# Altium schematic sheet xe.SchDoc
size A2
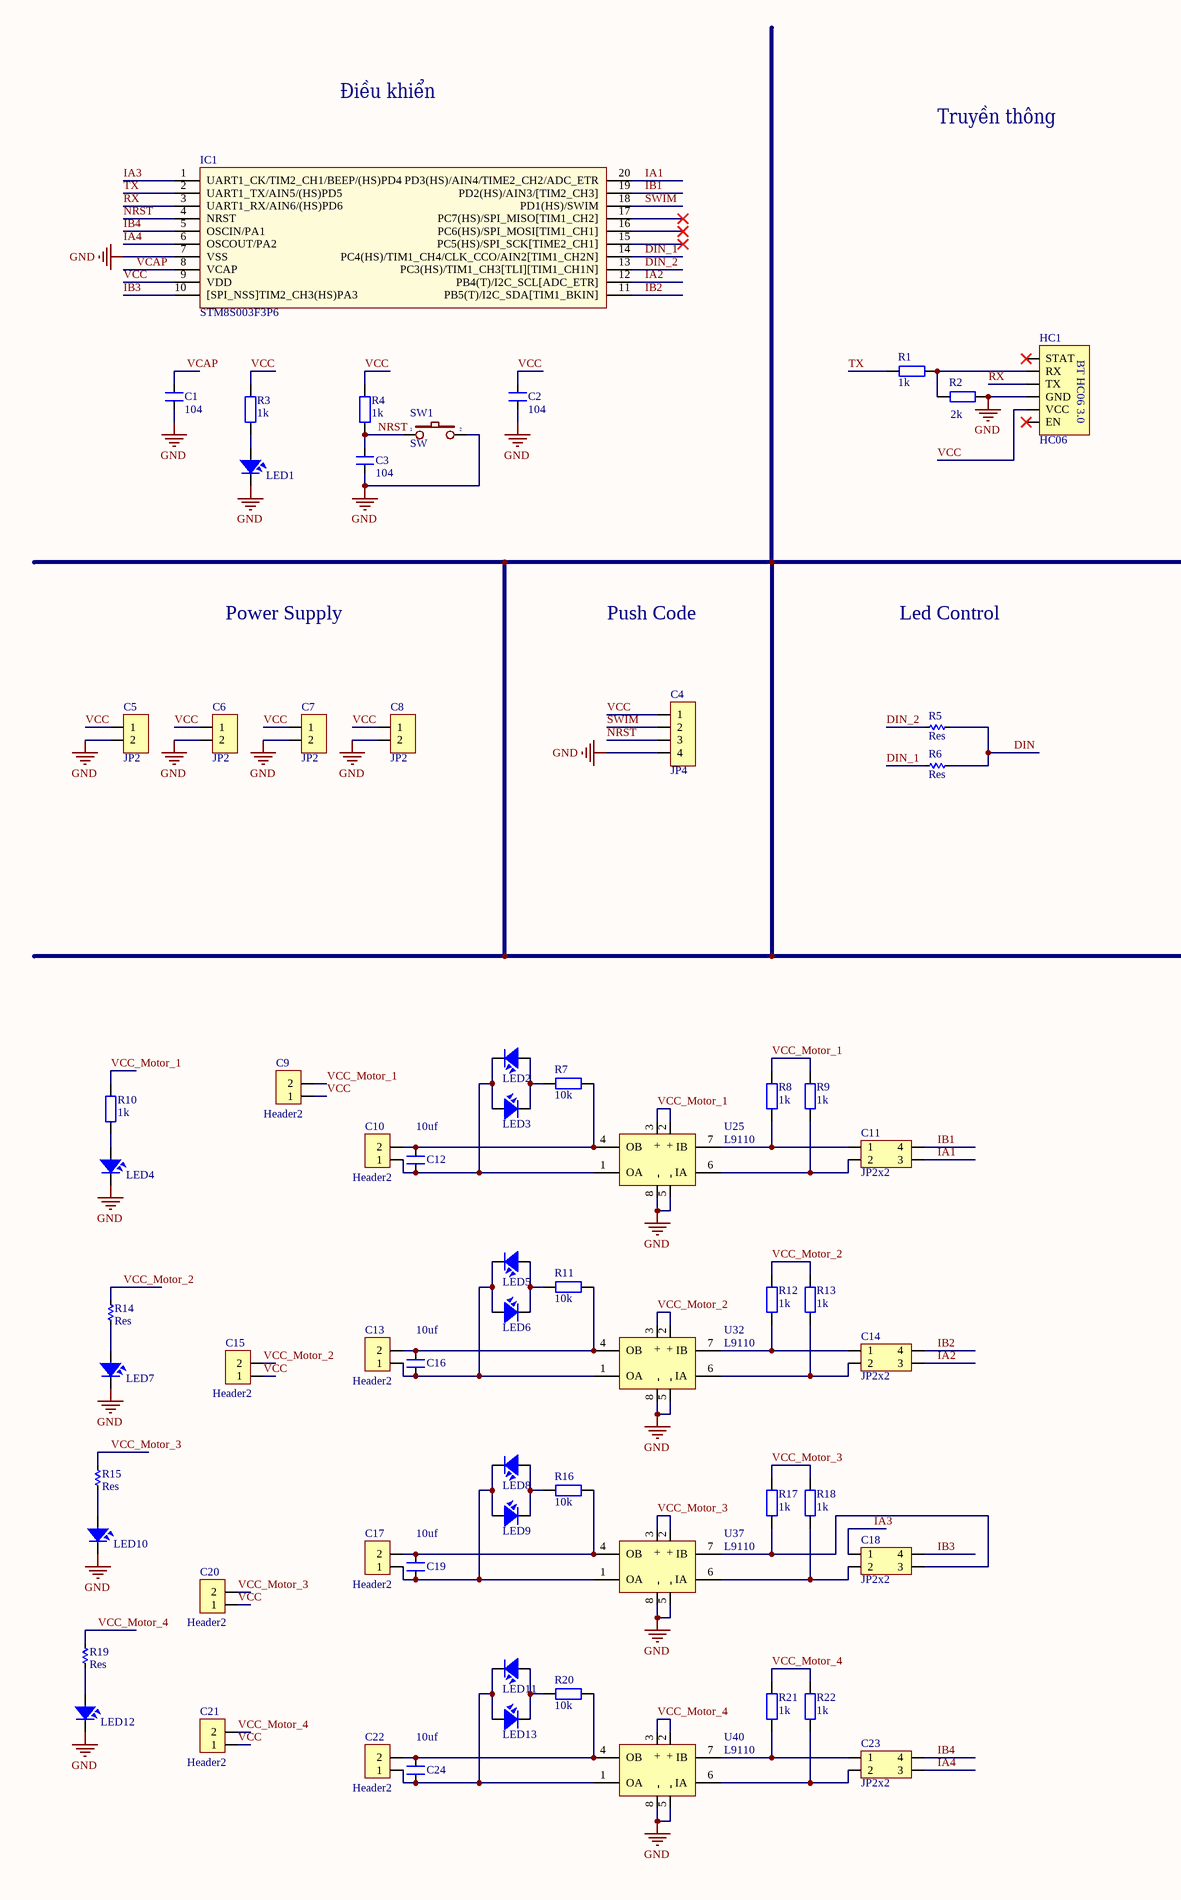
[diagram p0: xe.SchDoc, left]
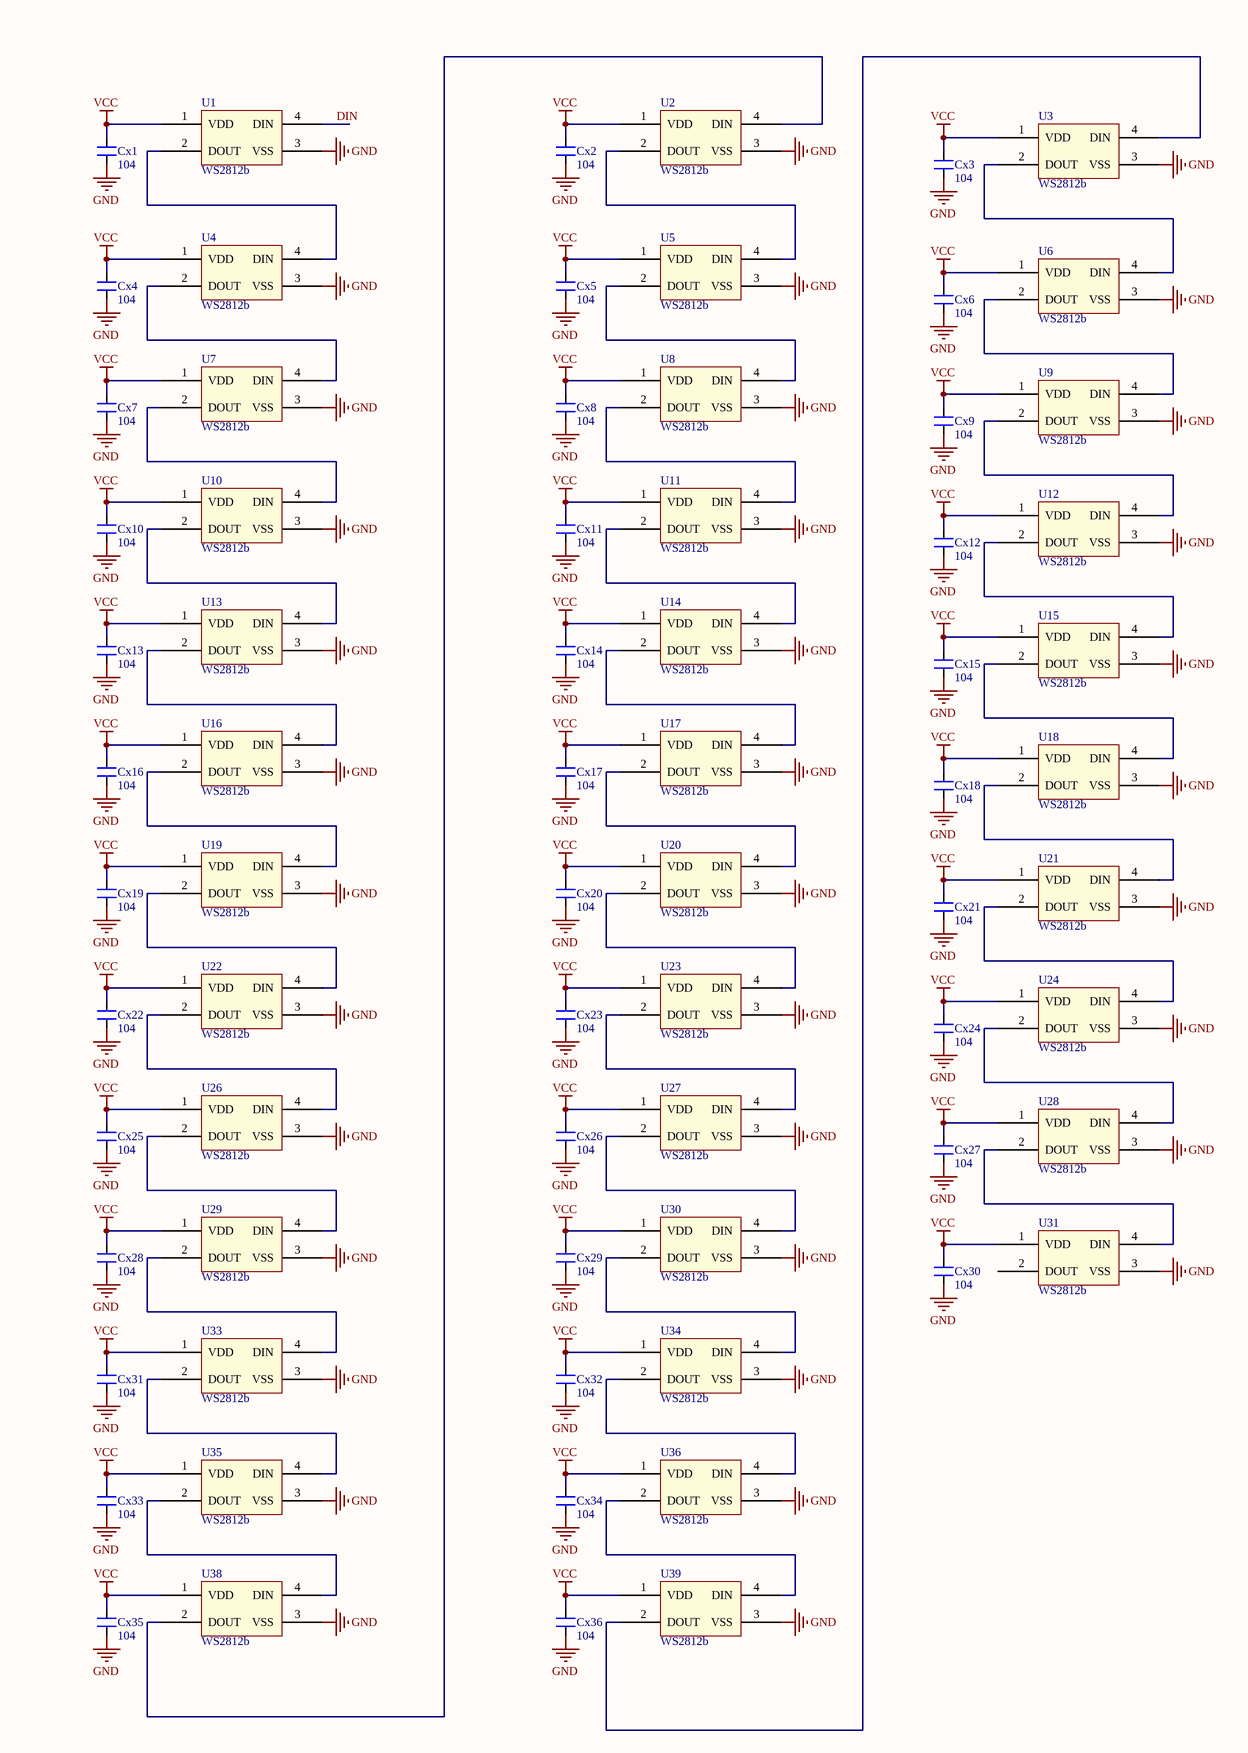
[diagram p1: xe.SchDoc, right]

## Parts
C1  104  [SM-CAP-0805]
C2  104  [SM-CAP-0805]
C3  104  [SM-CAP-0805]
C4  JP4  [JP4-D1C]
C5  JP2  [JP2-C1T]
C6  JP2  [JP2-C1T]
C7  JP2  [JP2-C1T]
C8  JP2  [JP2-C1T]
C9  Header2  [Header2]
C10  Header2  [Header2]
C11  JP2x2  [JP2-D2T]
C12  10uf  [SM-CAP-0805]
C13  Header2  [Header2]
C14  JP2x2  [JP2-D2T]
C15  Header2  [Header2]
C16  10uf  [SM-CAP-0805]
C17  Header2  [Header2]
C18  JP2x2  [JP2-D2T]
C19  10uf  [SM-CAP-0805]
C20  Header2  [Header2]
C21  Header2  [Header2]
C22  Header2  [Header2]
C23  JP2x2  [JP2-D2T]
C24  10uf  [SM-CAP-0805]
Cx1  104  [CN-SMD-0805]
Cx2  104  [CN-SMD-0805]
Cx3  104  [CN-SMD-0805]
Cx4  104  [CN-SMD-0805]
Cx5  104  [CN-SMD-0805]
Cx6  104  [CN-SMD-0805]
Cx7  104  [CN-SMD-0805]
Cx8  104  [CN-SMD-0805]
Cx9  104  [CN-SMD-0805]
Cx10  104  [CN-SMD-0805]
Cx11  104  [CN-SMD-0805]
Cx12  104  [CN-SMD-0805]
Cx13  104  [CN-SMD-0805]
Cx14  104  [CN-SMD-0805]
Cx15  104  [CN-SMD-0805]
Cx16  104  [CN-SMD-0805]
Cx17  104  [CN-SMD-0805]
Cx18  104  [CN-SMD-0805]
Cx19  104  [CN-SMD-0805]
Cx20  104  [CN-SMD-0805]
Cx21  104  [CN-SMD-0805]
Cx22  104  [CN-SMD-0805]
Cx23  104  [CN-SMD-0805]
Cx24  104  [CN-SMD-0805]
Cx25  104  [CN-SMD-0805]
Cx26  104  [CN-SMD-0805]
Cx27  104  [CN-SMD-0805]
Cx28  104  [CN-SMD-0805]
Cx29  104  [CN-SMD-0805]
Cx30  104  [CN-SMD-0805]
Cx31  104  [CN-SMD-0805]
Cx32  104  [CN-SMD-0805]
Cx33  104  [CN-SMD-0805]
Cx34  104  [CN-SMD-0805]
Cx35  104  [CN-SMD-0805]
Cx36  104  [CN-SMD-0805]
HC1  HC06  [HC06]
IC1  STM8S003F3P6  [TSSOP20]
LED1  LED SMD  [SM-LED-0805-Green]  (value not drawn)
LED2  LED  [LED-0805-Red]  (value not drawn)
LED3  LED  [LED-0805-Green]  (value not drawn)
LED4  LED  [LED-0805-Red]  (value not drawn)
LED5  LED  [LED-0805-Red]  (value not drawn)
LED6  LED  [LED-0805-Green]  (value not drawn)
LED7  LED  [LED-0805-Green]  (value not drawn)
LED8  LED  [LED-0805-Red]  (value not drawn)
LED9  LED  [LED-0805-Green]  (value not drawn)
LED10  LED  [LED-0805-Green]  (value not drawn)
LED11  LED  [LED-0805-Red]  (value not drawn)
LED12  LED  [LED-0805-Green]  (value not drawn)
LED13  LED  [LED-0805-Green]  (value not drawn)
R1  1k  [SM-RES-0805]
R2  2k  [SM-RES-0805]
R3  1k  [SM-RES-0805]
R4  1k  [SM-RES-0805]
R5  Res  [RES-SMD-0805]
R6  Res  [RES-SMD-0805]
R7  10k  [SM-RES-0805]
R8  1k  [SM-RES-0805]
R9  1k  [SM-RES-0805]
R10  1k  [SM-RES-0805]
R11  10k  [SM-RES-0805]
R12  1k  [SM-RES-0805]
R13  1k  [SM-RES-0805]
R14  Res  [RES-SMD-0805]
R15  Res  [RES-SMD-0805]
R16  10k  [SM-RES-0805]
R17  1k  [SM-RES-0805]
R18  1k  [SM-RES-0805]
R19  Res  [RES-SMD-0805]
R20  10k  [SM-RES-0805]
R21  1k  [SM-RES-0805]
R22  1k  [SM-RES-0805]
SW1  SW  [SW1-SMD]
U1  WS2812b  [PCBComponent_1 - duplicate]
U2  WS2812b  [PCBComponent_1 - duplicate]
U3  WS2812b  [PCBComponent_1 - duplicate]
U4  WS2812b  [PCBComponent_1 - duplicate]
U5  WS2812b  [PCBComponent_1 - duplicate]
U6  WS2812b  [PCBComponent_1 - duplicate]
U7  WS2812b  [PCBComponent_1 - duplicate]
U8  WS2812b  [PCBComponent_1 - duplicate]
U9  WS2812b  [PCBComponent_1 - duplicate]
U10  WS2812b  [PCBComponent_1 - duplicate]
U11  WS2812b  [PCBComponent_1 - duplicate]
U12  WS2812b  [PCBComponent_1 - duplicate]
U13  WS2812b  [PCBComponent_1 - duplicate]
U14  WS2812b  [PCBComponent_1 - duplicate]
U15  WS2812b  [PCBComponent_1 - duplicate]
U16  WS2812b  [PCBComponent_1 - duplicate]
U17  WS2812b  [PCBComponent_1 - duplicate]
U18  WS2812b  [PCBComponent_1 - duplicate]
U19  WS2812b  [PCBComponent_1 - duplicate]
U20  WS2812b  [PCBComponent_1 - duplicate]
U21  WS2812b  [PCBComponent_1 - duplicate]
U22  WS2812b  [PCBComponent_1 - duplicate]
U23  WS2812b  [PCBComponent_1 - duplicate]
U24  WS2812b  [PCBComponent_1 - duplicate]
U25  L9110  [SO8]
U26  WS2812b  [PCBComponent_1 - duplicate]
U27  WS2812b  [PCBComponent_1 - duplicate]
U28  WS2812b  [PCBComponent_1 - duplicate]
U29  WS2812b  [PCBComponent_1 - duplicate]
U30  WS2812b  [PCBComponent_1 - duplicate]
U31  WS2812b  [PCBComponent_1 - duplicate]
U32  L9110  [SO8]
U33  WS2812b  [PCBComponent_1 - duplicate]
U34  WS2812b  [PCBComponent_1 - duplicate]
U35  WS2812b  [PCBComponent_1 - duplicate]
U36  WS2812b  [PCBComponent_1 - duplicate]
U37  L9110  [SO8]
U38  WS2812b  [PCBComponent_1 - duplicate]
U39  WS2812b  [PCBComponent_1 - duplicate]
U40  L9110  [SO8]

## Nets
GND: C1.1 C2.1 C3.1 C4.4 C5.2 C6.2 C7.2 C8.2 Cx1.1 Cx2.1 Cx3.1 Cx4.1 Cx5.1 Cx6.1 Cx7.1 Cx8.1 Cx9.1 Cx10.1 Cx11.1 Cx12.1 Cx13.1 Cx14.1 Cx15.1 Cx16.1 Cx17.1 Cx18.1 Cx19.1 Cx20.1 Cx21.1 Cx22.1 Cx23.1 Cx24.1 Cx25.1 Cx26.1 Cx27.1 Cx28.1 Cx29.1 Cx30.1 Cx31.1 Cx32.1 Cx33.1 Cx34.1 Cx35.1 Cx36.1 HC1.4(GND) IC1.7(VSS) LED1.2 LED4.2 LED7.2 LED10.2 LED12.2 R2.1 SW1.2 U1.3(VSS) U2.3(VSS) U3.3(VSS) U4.3(VSS) U5.3(VSS) U6.3(VSS) U7.3(VSS) U8.3(VSS) U9.3(VSS) U10.3(VSS) U11.3(VSS) U12.3(VSS) U13.3(VSS) U14.3(VSS) U15.3(VSS) U16.3(VSS) U17.3(VSS) U18.3(VSS) U19.3(VSS) U20.3(VSS) U21.3(VSS) U22.3(VSS) U23.3(VSS) U24.3(VSS) U25.5(-) U25.8(-) U26.3(VSS) U27.3(VSS) U28.3(VSS) U29.3(VSS) U30.3(VSS) U31.3(VSS) U32.5(-) U32.8(-) U33.3(VSS) U34.3(VSS) U35.3(VSS) U36.3(VSS) U37.5(-) U37.8(-) U38.3(VSS) U39.3(VSS) U40.5(-) U40.8(-)
VCC: C2.2 C4.1 C5.1 C6.1 C7.1 C8.1 C9.1 C15.1 C20.1 C21.1 Cx1.2 Cx2.2 Cx3.2 Cx4.2 Cx5.2 Cx6.2 Cx7.2 Cx8.2 Cx9.2 Cx10.2 Cx11.2 Cx12.2 Cx13.2 Cx14.2 Cx15.2 Cx16.2 Cx17.2 Cx18.2 Cx19.2 Cx20.2 Cx21.2 Cx22.2 Cx23.2 Cx24.2 Cx25.2 Cx26.2 Cx27.2 Cx28.2 Cx29.2 Cx30.2 Cx31.2 Cx32.2 Cx33.2 Cx34.2 Cx35.2 Cx36.2 HC1.5(VCC) IC1.9(VDD) R3.2 R4.2 U1.1(VDD) U2.1(VDD) U3.1(VDD) U4.1(VDD) U5.1(VDD) U6.1(VDD) U7.1(VDD) U8.1(VDD) U9.1(VDD) U10.1(VDD) U11.1(VDD) U12.1(VDD) U13.1(VDD) U14.1(VDD) U15.1(VDD) U16.1(VDD) U17.1(VDD) U18.1(VDD) U19.1(VDD) U20.1(VDD) U21.1(VDD) U22.1(VDD) U23.1(VDD) U24.1(VDD) U26.1(VDD) U27.1(VDD) U28.1(VDD) U29.1(VDD) U30.1(VDD) U31.1(VDD) U33.1(VDD) U34.1(VDD) U35.1(VDD) U36.1(VDD) U38.1(VDD) U39.1(VDD)
DIN: R5.2 R6.2 U1.4(DIN)
DIN_1: IC1.14(PC4(HS)/TIM1_CH4/CLK_CCO/AIN2[TIM1_CH2N]) R6.1
DIN_2: IC1.13(PC3(HS)/TIM1_CH3[TLI][TIM1_CH1N]) R5.1
IA1: C11.3 IC1.20(PD3(HS)/AIN4/TIME2_CH2/ADC_ETR)
IA2: C14.3 IC1.12(PB4(T)/I2C_SCL[ADC_ETR])
IA3: C18.1 IC1.1(UART1_CK/TIM2_CH1/BEEP/(HS)PD4)
IA4: C23.3 IC1.6(OSCOUT/PA2)
IB1: C11.4 IC1.19(PD2(HS)/AIN3/[TIM2_CH3])
IB2: C14.4 IC1.11(PB5(T)/I2C_SDA[TIM1_BKIN])
IB3: C18.4 IC1.10([SPI_NSS]TIM2_CH3(HS)PA3)
IB4: C23.4 IC1.5(OSCIN/PA1)
NRST: C3.2 C4.3 IC1.4(NRST) R4.1 SW1.1
RX: HC1.3(TX) IC1.3(UART1_RX/AIN6/(HS)PD6)
SWIM: C4.2 IC1.18(PD1(HS)/SWIM)
TX: IC1.2(UART1_TX/AIN5/(HS)PD5) R1.2
VCAP: C1.2 IC1.8(VCAP)
VCC_Motor_1: C9.2 R8.2 R9.2 R10.1 U25.2(+) U25.3(+)
VCC_Motor_2: C15.2 R12.2 R13.2 R14.1 U32.2(+) U32.3(+)
VCC_Motor_3: C20.2 R15.1 R17.2 R18.2 U37.2(+) U37.3(+)
VCC_Motor_4: C21.2 R19.1 R21.2 R22.2 U40.2(+) U40.3(+)
NetC10_1: C10.1 C12.1 LED2.2 LED3.1 U25.1(OA)
NetC10_2: C10.2 C12.2 R7.1 U25.4(OB)
NetC11_1: C11.1 R8.1 U25.7(IB)
NetC11_2: C11.2 R9.1 U25.6(IA)
NetC13_1: C13.1 C16.1 LED5.2 LED6.1 U32.1(OA)
NetC13_2: C13.2 C16.2 R11.1 U32.4(OB)
NetC14_1: C14.1 R12.1 U32.7(IB)
NetC14_2: C14.2 R13.1 U32.6(IA)
NetC17_1: C17.1 C19.1 LED8.2 LED9.1 U37.1(OA)
NetC17_2: C17.2 C19.2 R16.1 U37.4(OB)
NetC18_2: C18.2 R18.1 U37.6(IA)
NetC18_3: C18.3 R17.1 U37.7(IB)
NetC22_1: C22.1 C24.1 LED11.2 LED13.1 U40.1(OA)
NetC22_2: C22.2 C24.2 R20.1 U40.4(OB)
NetC23_1: C23.1 R21.1 U40.7(IB)
NetC23_2: C23.2 R22.1 U40.6(IA)
NetHC1_2: HC1.2(RX) R1.1 R2.2
NetLED1_1: LED1.1 R3.1
NetLED2_1: LED2.1 LED3.2 R7.2
NetLED4_1: LED4.1 R10.2
NetLED5_1: LED5.1 LED6.2 R11.2
NetLED7_1: LED7.1 R14.2
NetLED8_1: LED8.1 LED9.2 R16.2
NetLED10_1: LED10.1 R15.2
NetLED11_1: LED11.1 LED13.2 R20.2
NetLED12_1: LED12.1 R19.2
NetU1_2: U1.2(DOUT) U4.4(DIN)
NetU2_2: U2.2(DOUT) U5.4(DIN)
NetU2_4: U2.4(DIN) U38.2(DOUT)
NetU3_2: U3.2(DOUT) U6.4(DIN)
NetU3_4: U3.4(DIN) U39.2(DOUT)
NetU4_2: U4.2(DOUT) U7.4(DIN)
NetU5_2: U5.2(DOUT) U8.4(DIN)
NetU6_2: U6.2(DOUT) U9.4(DIN)
NetU7_2: U7.2(DOUT) U10.4(DIN)
NetU8_2: U8.2(DOUT) U11.4(DIN)
NetU9_2: U9.2(DOUT) U12.4(DIN)
NetU10_2: U10.2(DOUT) U13.4(DIN)
NetU11_2: U11.2(DOUT) U14.4(DIN)
NetU12_2: U12.2(DOUT) U15.4(DIN)
NetU13_2: U13.2(DOUT) U16.4(DIN)
NetU14_2: U14.2(DOUT) U17.4(DIN)
NetU15_2: U15.2(DOUT) U18.4(DIN)
NetU16_2: U16.2(DOUT) U19.4(DIN)
NetU17_2: U17.2(DOUT) U20.4(DIN)
NetU18_2: U18.2(DOUT) U21.4(DIN)
NetU19_2: U19.2(DOUT) U22.4(DIN)
NetU20_2: U20.2(DOUT) U23.4(DIN)
NetU21_2: U21.2(DOUT) U24.4(DIN)
NetU22_2: U22.2(DOUT) U26.4(DIN)
NetU23_2: U23.2(DOUT) U27.4(DIN)
NetU24_2: U24.2(DOUT) U28.4(DIN)
NetU26_2: U26.2(DOUT) U29.4(DIN)
NetU27_2: U27.2(DOUT) U30.4(DIN)
NetU28_2: U28.2(DOUT) U31.4(DIN)
NetU29_2: U29.2(DOUT) U33.4(DIN)
NetU30_2: U30.2(DOUT) U34.4(DIN)
NetU33_2: U33.2(DOUT) U35.4(DIN)
NetU34_2: U34.2(DOUT) U36.4(DIN)
NetU35_2: U35.2(DOUT) U38.4(DIN)
NetU36_2: U36.2(DOUT) U39.4(DIN)

Not connected (* = marked no-connect by the designer): HC1 1(STAT)* 6(EN)*; IC1 15(PC5(HS)/SPI_SCK[TIME2_CH1])* 16(PC6(HS)/SPI_MOSI[TIM1_CH1])* 17(PC7(HS)/SPI_MISO[TIM1_CH2])*; U31 2(DOUT)

## Notes on the sheet
- Điều khiển
- Truyền thông
- Power Supply
- Push Code
- Led Control
- (in symbol HC06) BT HC06 3.0

## Library data of the parts
C1-C3 C12 C16 C19 C24 = CN: Value: 0,1uF/300V; Designed by: VanDungEvn
C4 = JP4: WR-PHD 2.54 mm Angled Socket Header; Manufacturer: W¨¹rth Elektronik eiSos GmbH; partNo: 613004143121; ComponentLink1 Description: Manufacturer; ComponentLink2 Description: Datasheet; NoPins: 04; Created Date: 29 March 2013; ComponentLink1URL: http://www.we-online.com; ComponentLink2URL: http://katalog.we-online.de/em/datasheet/6130xx143121.pdf; Created by: Karrer Zheng
C5-C8 = JP2: WR-PHD 2.54 mm Angled Socket Header; Manufacturer: W¨¹rth Elektronik eiSos GmbH; partNo: 613002143121; ComponentLink1 Description: Manufacturer; ComponentLink2 Description: Datasheet; NoPins: 02; Created Date: 29 March 2013; ComponentLink1URL: http://www.we-online.com; ComponentLink2URL: http://katalog.we-online.de/em/datasheet/6130xx143121.pdf; Created by: Karrer Zheng
C9 C10 C13 C15 C17 C20-C22 = Header2: Header IDC, 2 x 1 Pin Vertical 2.54mm Pitch (Non-Boxed, Male); Manufacturer: W¨¹rth Elektronik eiSos GmbH; partNo: 613002143121; ComponentLink1 Description: Manufacturer; ComponentLink2 Description: Datasheet; NoPins: 02; Created Date: 29 March 2013; ComponentLink1URL: http://www.we-online.com; ComponentLink2URL: http://katalog.we-online.de/em/datasheet/6130xx143121.pdf; Created by: Karrer Zheng
C11 C14 C18 C23 = JP2x2: WR-PHD 2.54 mm Dual Socket Header; Manufacturer: W¨¹rth Elektronik eiSos GmbH; partNo: 61300421821; ComponentLink1 Description: Manufacturer; ComponentLink2 Description: Datasheet; NoPins: 04; Created Date: 29 March 2013; ComponentLink1URL: http://www.we-online.com; ComponentLink2URL: http://katalog.we-online.de/em/datasheet/6130xx21821.pdf; Created by: Karrer Zheng
Cx1-Cx36 = CN: Value: 33pF
HC1 = HC06: Manufacturer: W¨¹rth Elektronik eiSos GmbH; partNo: 613004143121; ComponentLink1 Description: Manufacturer; ComponentLink2 Description: Datasheet; NoPins: 04; Created Date: 29 March 2013; ComponentLink1URL: http://www.we-online.com; ComponentLink2URL: http://katalog.we-online.de/em/datasheet/6130xx143121.pdf; Created by: Karrer Zheng
IC1 = STM8S003F3P6: MCU 8BIT  8KB FLASH TSSOP-20; Value: 24Cxx; Value: DIP 8; Copyright by: VanDungEvn
LED1 = LED-SMD-0805
LED2-LED13 = LED SMD: Value: LED 3 - 5 ly 2 Colour
R1-R4 R7-R13 R16-R18 R20-R22 = R1/4W: Resistor 1/4W; Value: R1/4W - 1K
R5 R6 R14 R15 R19 = Res-SMD: Resistor; Manufacturer: Generic Components; Class: Passive; Published: 08/06/2000; Publisher: Altium Hobart Technology Centre
SW1 = SW2: Switch button 2 pin; Value: SW chip 2 pin
U25 U32 U37 U40 = L9110: Half-Bridge Driver